# EAGLE design QRE1113_Digital_v10 (EAGLE 6.2)
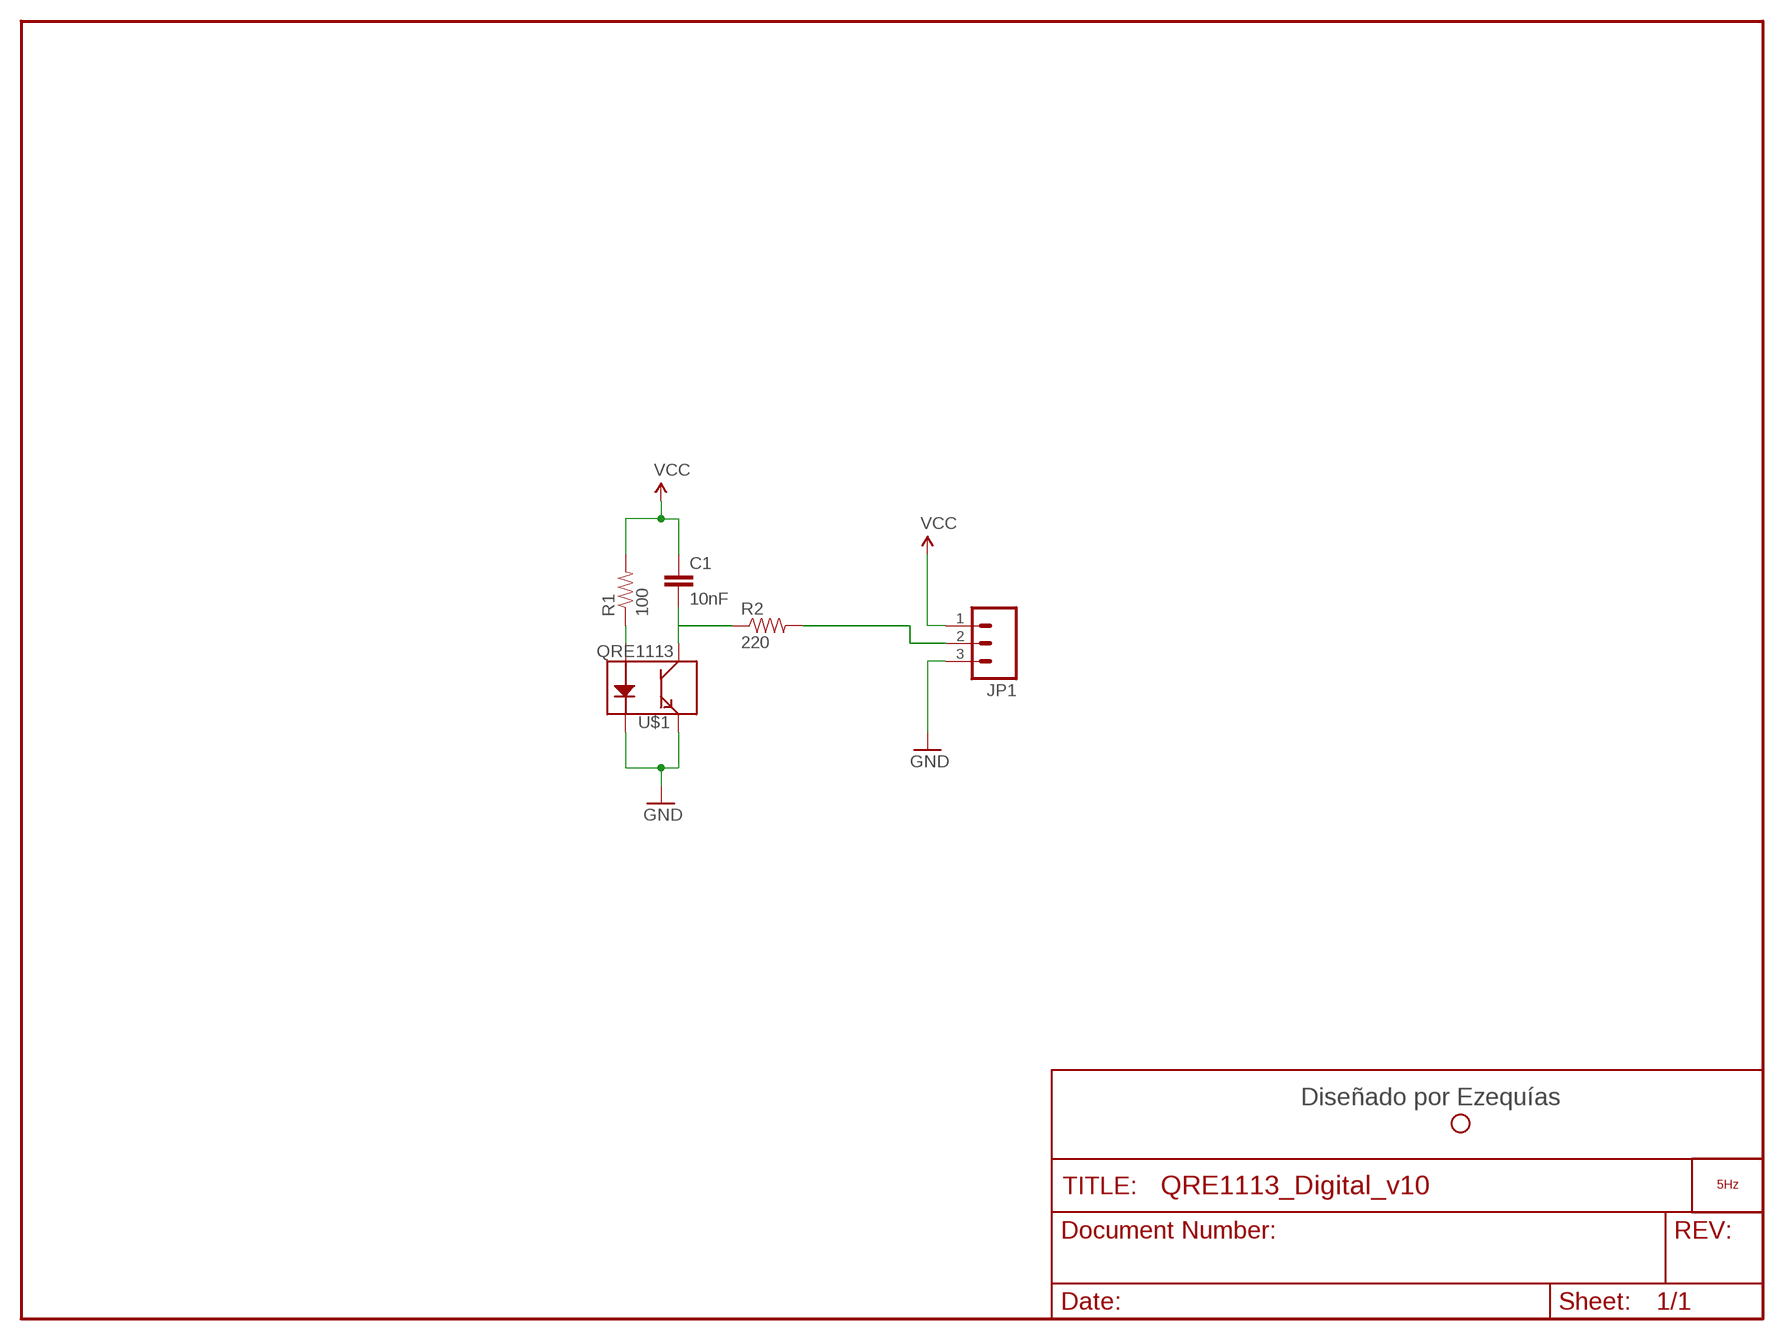
[diagram p0: schematic, sheet 1]

## Parts
C1  10nF  CAP0603-CAP  [0603-CAP]
JP1  M03PTH  [1X03]
JP2  STAND-OFF  [STAND-OFF]
LOGO1  LOGO_5HZ_CIRC_5MM  [5HZ_LOGO_CIRC_5MM]
R1  100  RESISTOR0603-RES  [0603-RES]
R2  220  RESISTOR0603-RES  [0603-RES]
U$1  QRE1113  [QRE1113]

## Nets
GND: JP1.3 U$1.2(K) U$1.4(E)
N$1: C1.2 R2.1 U$1.3(C)
N$2: R1.1 U$1.1(A)
N$3: JP1.2 R2.2
VCC: C1.1 JP1.1 R1.2

## Notes on the sheet
- Diseñado por Ezequías

## Library data of the parts
C1 = SparkFun:CAP: Capacitor Standard 0603 ceramic capacitor, and 0.1" leaded capacitor.
JP1 = SparkFun:M03: Header 3 Standard 3-pin 0.1" header. Use with straight break away headers (SKU : PRT-00116), right angle break away headers (PRT-00553), swiss pins (PRT-00743), machine pins (PRT-00117), and female headers (PRT-00115). Molex polarized connector foot print use with SKU : PRT-08232 with associated crimp pins and housings.
JP2 = SparkFun:STAND-OFF: Stand Off This is the mechanical footprint for a #4 phillips button head screw. Use the keepout ring to avoid running the screw head into surrounding components. SKU : PRT-00447
LOGO1 = 5hz-electronica:LOGO_5HZ: Logotipo 5Hz "según Pedro"
R1 R2 = 5hz-electronica:RESISTOR: Resistor Basic schematic elements and footprints for 0603, 1206, and PTH 1/10th watt (small) resistors.
U$1 = SparkFun:QRE1113

## Board
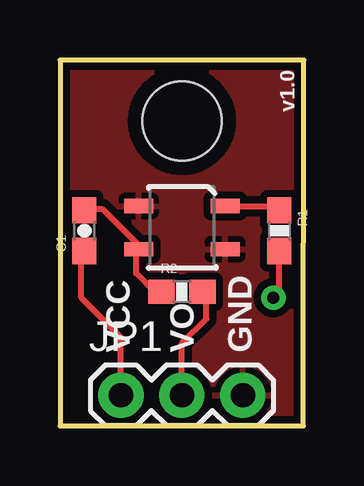
[diagram p1: board, top side]
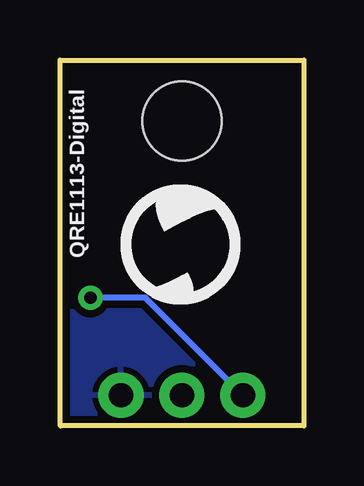
[diagram p2: board, bottom side, seen from below]

Size 10.16 x 15.24 mm. Coordinates in mm from the lower left corner, seen from the top.
Outline: 0,0 10.14,0 10.16,15.24 0,15.24 0,0
Copper layers (1*16): Top 0.035mm / dielectric 1.5mm / Bottom 0.035mm
Design rules "SparkFun": minimum track width 8mil, minimum drill 20mil, track to track 8mil, track to pad 8mil, pad to pad 8mil, via to via 8mil, smd to smd 8mil, copper to edge 10mil, drill to drill 8mil, minimum pad ring 12mil, minimum via ring 10mil, stop-mask expansion 4mil, vias tented up to drill 25mil, thermal gap 10mil

### Footprints (pad centres in the part's own frame; a part is rotated, then mirrored left to right if it is on the bottom)
0603-CAP = smd 1.1 x 1: 1 -0.85,0; 2 0.85,0
1X03 = drill 1.016 pad 1.88 round: 1 0,0; 2 2.54,0; 3 5.08,0
STAND-OFF = hole 3.302: 0,0
0603-RES = smd 1.1 x 1: 1 -0.85,0; 2 0.85,0
QRE1113 = smd 1.2 x 0.6: 1 -1.8,-0.9; 2 1.8,-0.9; 3 1.8,0.9; 4 -1.8,0.9

### Placement (x,y rotation side)
C1  1.02,8.13 90 top
JP1  2.54,1.27 0 top
JP2  5.08,12.7 0 top
LOGO1  7.62,5.08 0 bottom
R1  9.14,8.13 270 top
R2  5.08,5.59 0 top
U$1  5.08,8.26 180 top

### Tracks (layer width: path | path; a pad name or v marks a point on that pad's centre or on a via)
GND
  pour Bottom (isolate 0.305): 0,15.24 0,0 10.16,0 10.16,15.24
  pour Top (isolate 0.305): 0,15.24 0,0 10.16,0 10.16,15.24
N$1
  Top 0.254: R2.1 3.94,5.59 3.17,6.35 3.17,7.25 U$1.3 3.28,7.51 1.78,9.02 1.05,9.02 C1.2
N$2
  Top 0.254: U$1.1 8.97,9.15 R1.1
N$3
  Top 0.254: JP1.2 5.08,3.43 6.1,4.45 6.1,5.42 R2.2
VCC  (via drill 0.51)
  Top 0.254: JP1.1 2.54,3.68 0.89,5.33 0.89,7.15 C1.1 | R1.2 9.14,5.59 v8.89,5.33
  Bottom 0.254: v8.89,5.33 6.6,5.33 JP1.1

### Text on the board
tPlace: v1.0 | VCC | VO | GND
bPlace: QRE1113-Digital